# EasyEDA schematic ESP32板子.json
TITLE: Sheet_1; REV: 1.0; Date: 2021-07-28; Sheet: 1/1; Drawn By: chenzhinong; Company: Your Company
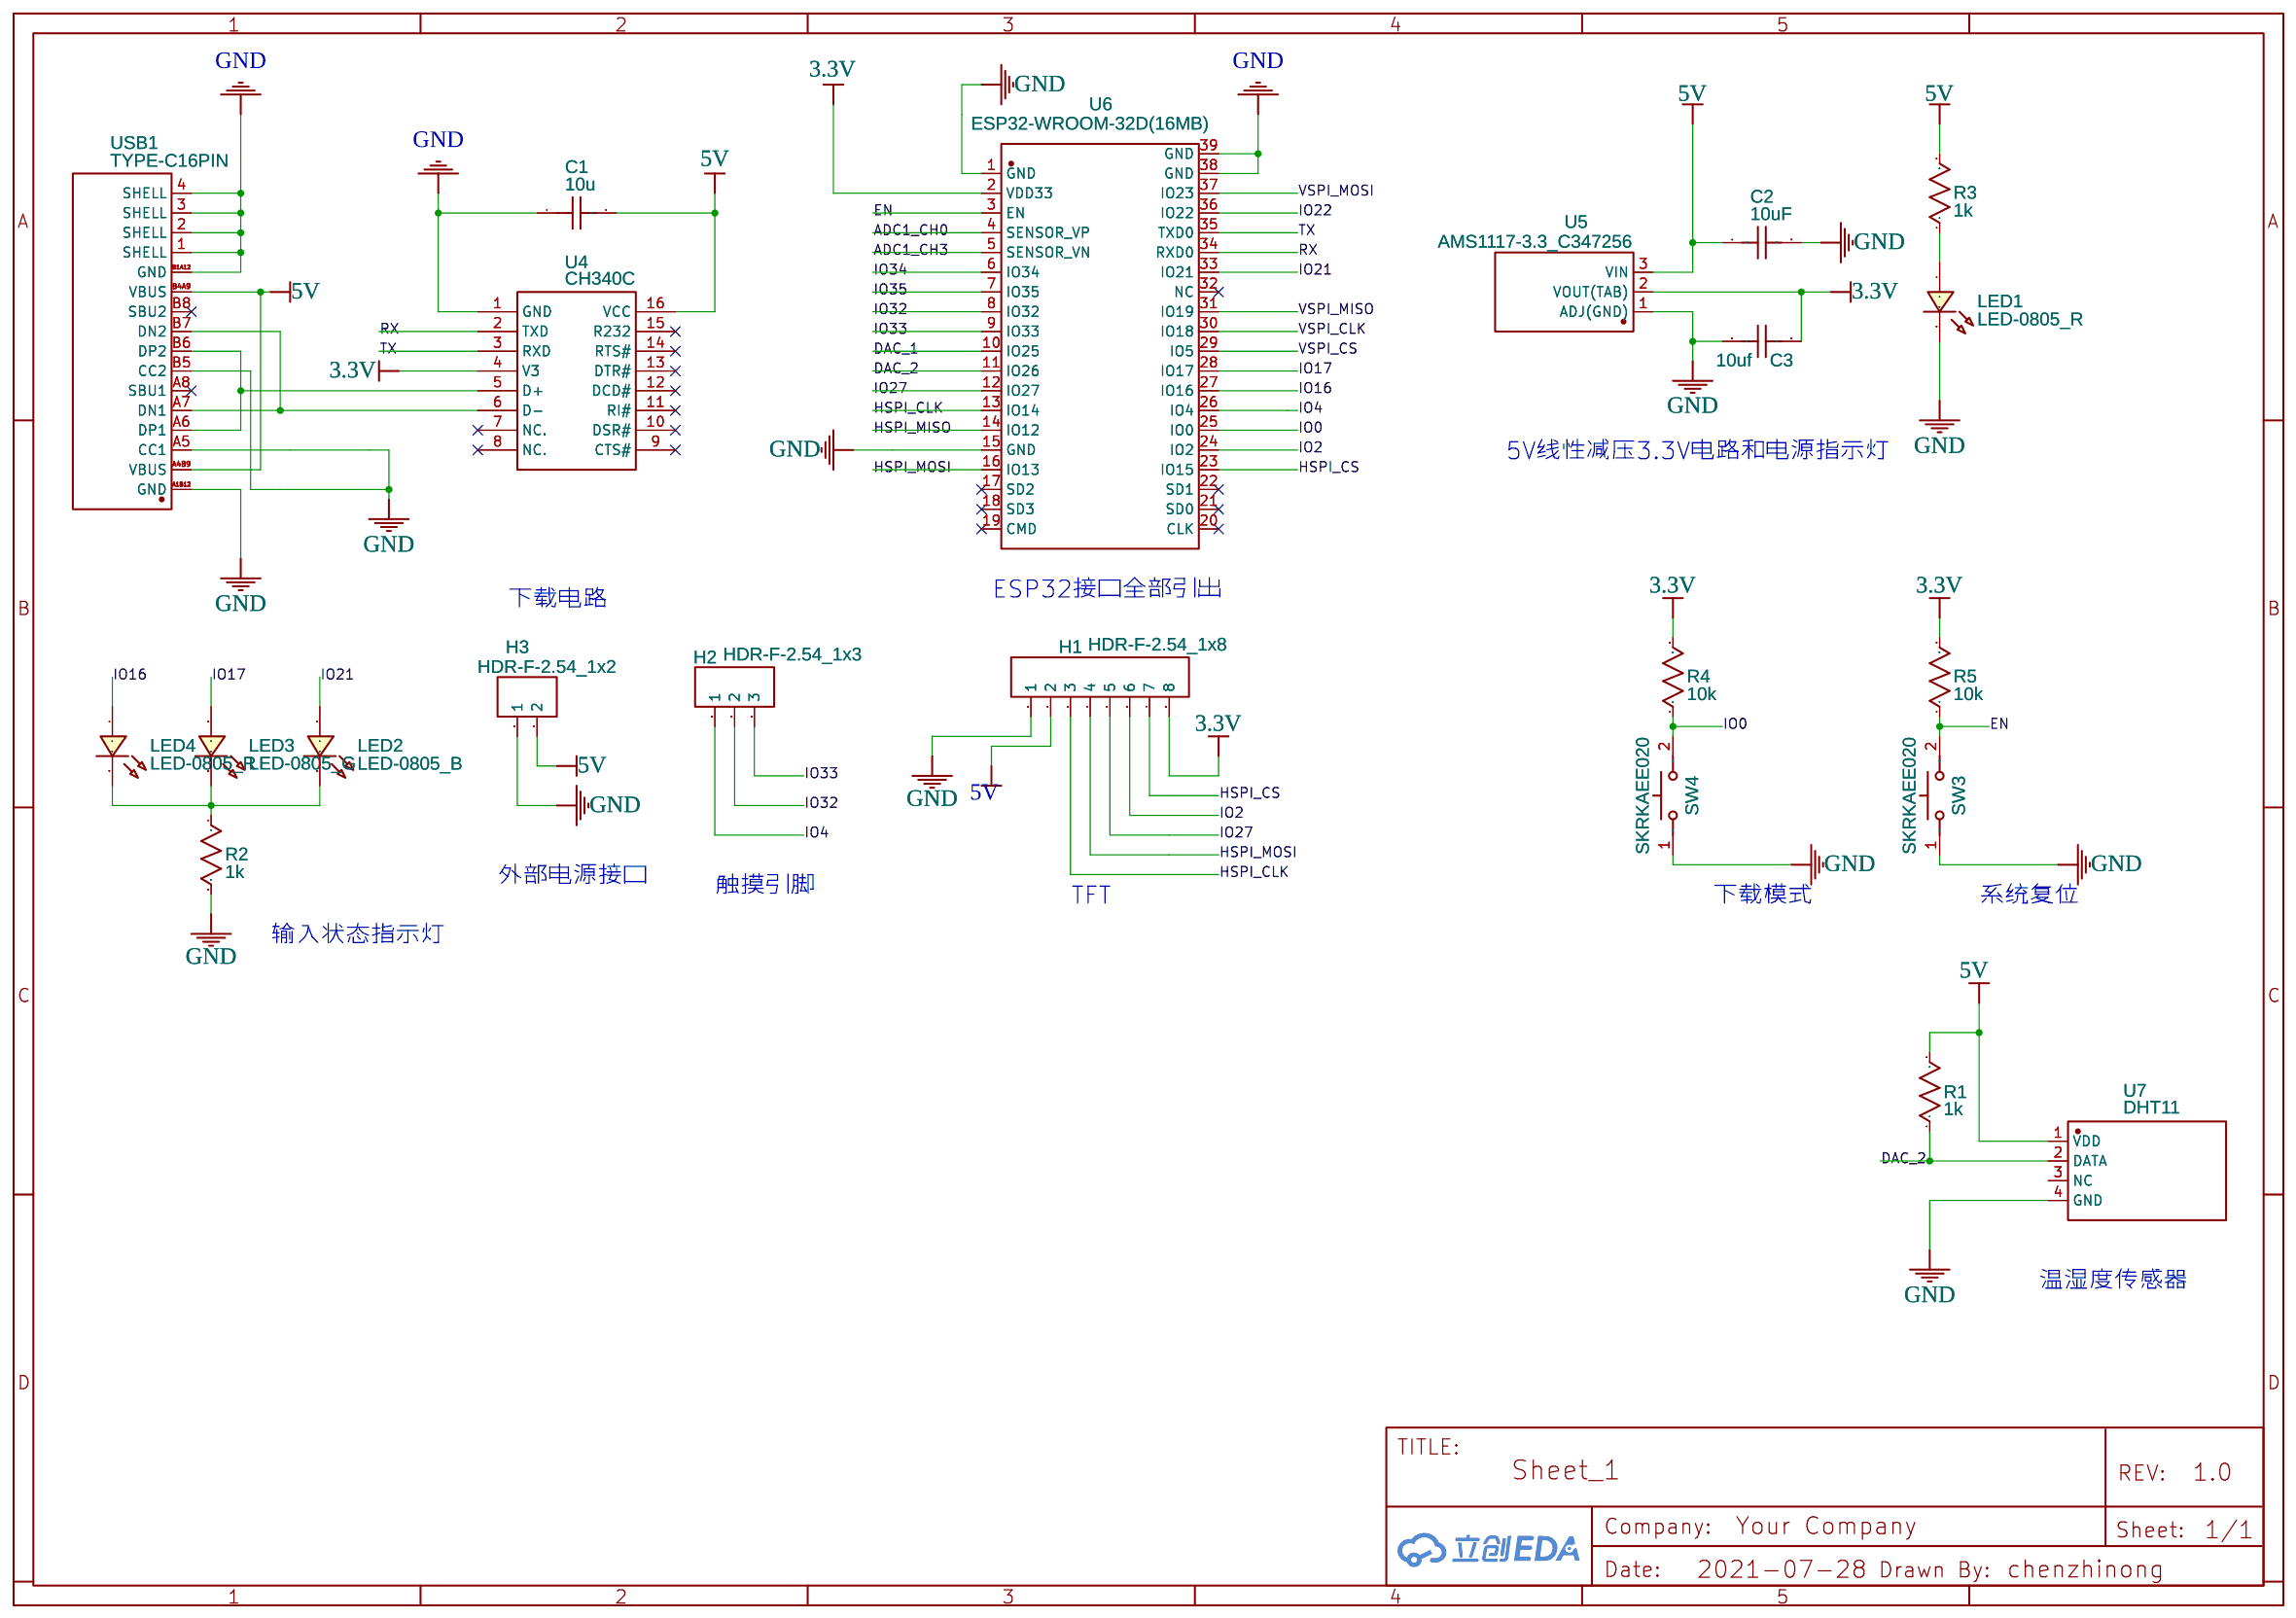
[diagram p0: schematic sheet]

## Parts
C1  10u  [C0805]
C2  10uF  [C0805]
C3  10uf  [C0805]
H1  HDR-F-2.54_1x8  [HDR-F-2.54_1X8]
H2  HDR-F-2.54_1x3  [HDR-F-2.54_1X3]
H3  HDR-F-2.54_1x2  [HDR-F-2.54_1X2]
LED1  LED-0805_R  [LED0805_RED]
LED2  LED-0805_B  [LED0805_BLUE]
LED3  LED-0805_G  [LED0805_GREEN]
LED4  LED-0805_R  [LED0805_RED]
R1  1k  [R0805]
R2  1k  [R0805]
R3  1k  [R0805]
R4  10k  [R0805]
R5  10k  [R0805]
SW3  SKRKAEE020  [SW-SMD_L3.9-W3.0-P4.45]
SW4  SKRKAEE020  [SW-SMD_L3.9-W3.0-P4.45]
U4  CH340C  [SOP-16_L10.0-W3.9-P1.27-LS6.0-BL]
U5  AMS1117-3.3_C347256  [SOT-89_L4.5-W2.5-P1.50-LS4.2-BR]
U6  ESP32-WROOM-32D(16MB)  [WIFIM-SMD_39P-L25.5-W18.0-P1.27-BL]
U7  DHT11  [SENSOR-TH_DHT11]
USB1  TYPE-C16PIN  [USB-C-SMD_TYPE-C16PIN]

## Library data of the parts
C1-C3 = C_0603_US: Contributor: LCEDA_Lib
H1 = HDR-F-2.54_1x8: Supplier Part: C225505; Supplier: LCSC; Contributor: LCEDA_Lib
H2 = HDR-F-2.54_1x3: Supplier Part: C146690; Supplier: LCSC; Contributor: LCEDA_Lib
H3 = HDR-F-2.54_1x2: Supplier Part: C49661; Supplier: LCSC; Contributor: LCEDA_Lib
LED1 LED4 = LED-0805_R: Manufacturer: EVERLIGHT(台湾亿光); Manufacturer Part: 17-21SURC/S530-A3/TR8; Supplier Part: C72037; Contributor: LCEDA_Lib
LED2 = LED-0805_B: Manufacturer: 方舟 ARKLED; Manufacturer Part: D-B080508B1-KS2; Supplier Part: C108412; Contributor: LCEDA_Lib
LED3 = LED-0805_G: Manufacturer: 国星光电; Manufacturer Part: NCD0805G1; Supplier Part: C84260; Contributor: LCEDA_Lib
R1 R2 R4 R5 = R_0805_US: Contributor: LCEDA_Lib
R3 = R_0603_US: Contributor: LCEDA_Lib
SW3 SW4 = SKRKAEE020: Supplier: LCSC; Manufacturer: ALPS; Supplier Part: C115357; JLCPCB Part Class: Extended Part
U4 = CH340C: Supplier: LCSC; Manufacturer: WCH; Supplier Part: C84681; Paste Type: recommend
U5 = AMS1117-3.3_C347256: Supplier: LCSC; Supplier Part: C347256; Manufacturer: Youtai Semiconductor Co., Ltd.; Manufacturer Part: AMS1117-3.3; Contributor: LCSC; Paste Type: expand
U6 = ESP32-WROOM-32D(16MB): Supplier: LCSC; Supplier Part: C529578; Manufacturer: Espressif Systems; Contributor: LCSC; Paste Type: expand
U7 = DHT11: Supplier: LCSC; Supplier Part: C117051; Manufacturer: Aosong (Guangzhou) Elec; Contributor: LCSC; JLCPCB Part Class: Extended Part
USB1 = TYPE-C16PIN: Supplier: LCSC; Supplier Part: C393939; Manufacturer: SHOU HAN; Contributor: LCSC

## Nets
3.3V: C3.1 H1.8 R4.2 R5.2 U4.4(V3) U5.2(VOUT(TAB)) U6.2(VDD33)
5V: C1.2 C2.1 H1.2 H3.2 R1.2 R3.2 U4.16(VCC) U5.3(VIN) U7.1(VDD) USB1.A4B9(VBUS) USB1.B4A9(VBUS)
GND: C1.1 C2.2 C3.2 H1.1 H3.1 LED1.2 R2.2 SW3.1 SW4.1 U4.1(GND) U5.1(ADJ(GND)) U6.1(GND) U6.15(GND) U6.38(GND) U6.39(GND) U7.4(GND) USB1.1(SHELL) USB1.2(SHELL) USB1.3(SHELL) USB1.4(SHELL) USB1.A1B12(GND) USB1.A5(CC1) USB1.B1A12(GND) USB1.B5(CC2)
ADC1_CH0: U6.4(SENSOR_VP)
ADC1_CH3: U6.5(SENSOR_VN)
DAC_1: U6.10(IO25)
DAC_2: R1.1 U6.11(IO26) U7.2(DATA)
EN: R5.1 SW3.2 U6.3(EN)
HSPI_CLK: H1.3 U6.13(IO14)
HSPI_CS: H1.7 U6.23(IO15)
HSPI_MISO: U6.14(IO12)
HSPI_MOSI: H1.4 U6.16(IO13)
IO0: R4.1 SW4.2 U6.25(IO0)
IO2: H1.6 U6.24(IO2)
IO4: H2.1 U6.26(IO4)
IO16: LED4.1 U6.27(IO16)
IO17: LED3.1 U6.28(IO17)
IO21: LED2.1 U6.33(IO21)
IO22: U6.36(IO22)
IO27: H1.5 U6.12(IO27)
IO32: H2.2 U6.8(IO32)
IO33: H2.3 U6.9(IO33)
IO34: U6.6(IO34)
IO35: U6.7(IO35)
RX: U4.2(TXD) U6.34(RXD0)
TX: U4.3(RXD) U6.35(TXD0)
VSPI_CLK: U6.30(IO18)
VSPI_CS: U6.29(IO5)
VSPI_MISO: U6.31(IO19)
VSPI_MOSI: U6.37(IO23)
Net-(LED1-1): LED1.1 R3.1
Net-(LED2-2): LED2.2 LED3.2 LED4.2 R2.1
Net-(U4-5): U4.5(D+) USB1.A6(DP1) USB1.B6(DP2)
Net-(U4-6): U4.6(D-) USB1.A7(DN1) USB1.B7(DN2)

Not connected (* = marked no-connect by the designer): U4 7(NC.)* 8(NC.)* 9(CTS#)* 10(DSR#)* 11(RI#)* 12(DCD#)* 13(DTR#)* 14(RTS#)* 15(R232)*; U6 17(SD2)* 18(SD3)* 19(CMD)* 20(CLK)* 21(SD0)* 22(SD1)* 32(NC)*; U7 3(NC); USB1 A8(SBU1)* B8(SBU2)*

## Notes on the sheet
- 5V线性减压3.3V电路和电源指示灯
- ESP32接口全部引出
- 下载电路
- 外部电源接口
- 触摸引脚
- TFT
- 下载模式
- 系统复位
- 输入状态指示灯
- 温湿度传感器
